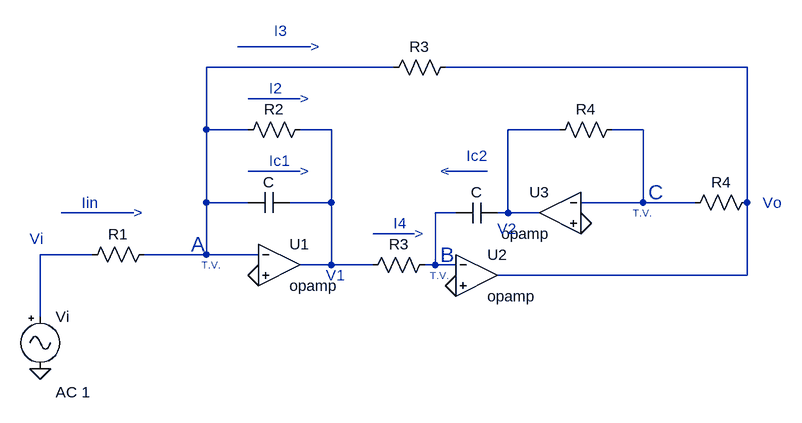
[diagram p0: schematic TS2_analisis.asc]
TS2_analisis.asc, the LTspice schematic file:
Version 4
SHEET 1 880 680
WIRE 96 -192 -16 -192
WIRE 224 -160 -64 -160
WIRE 768 -160 304 -160
WIRE 80 -112 0 -112
WIRE -64 -64 -64 -160
WIRE 0 -64 -64 -64
WIRE 128 -64 80 -64
WIRE 480 -64 400 -64
WIRE 608 -64 560 -64
WIRE 80 0 0 0
WIRE 368 0 304 0
WIRE -64 48 -64 -64
WIRE 0 48 -64 48
WIRE 128 48 128 -64
WIRE 128 48 64 48
WIRE 608 48 608 -64
WIRE 608 48 512 48
WIRE 688 48 608 48
WIRE 768 48 768 -160
WIRE -176 64 -288 64
WIRE 320 64 288 64
WIRE 400 64 400 -64
WIRE 400 64 384 64
WIRE 448 64 400 64
WIRE 256 96 192 96
WIRE -240 128 -320 128
WIRE -64 128 -64 48
WIRE -64 128 -160 128
WIRE 16 128 -64 128
WIRE 128 144 128 48
WIRE 128 144 80 144
WIRE 192 144 128 144
WIRE 288 144 288 64
WIRE 288 144 272 144
WIRE 320 144 288 144
WIRE 768 160 768 48
WIRE 768 160 384 160
WIRE -320 224 -320 128
FLAG 320 176 0
FLAG 16 160 0
FLAG 512 80 0
FLAG -320 304 0
SYMBOL OpAmps\\opamp 48 80 R0
SYMATTR InstName U1
SYMBOL OpAmps\\opamp 352 96 R0
SYMATTR InstName U2
SYMBOL OpAmps\\opamp 480 0 M0
SYMATTR InstName U3
SYMBOL res 576 -80 R90
WINDOW 0 0 56 VBottom 2
WINDOW 3 32 56 VTop 2
SYMATTR InstName R4
SYMATTR Value ""
SYMBOL res 784 32 R90
WINDOW 0 0 56 VBottom 2
WINDOW 3 32 56 VTop 2
SYMATTR InstName R4
SYMATTR Value ""
SYMBOL res 288 128 R90
WINDOW 0 0 56 VBottom 2
WINDOW 3 32 56 VTop 2
SYMATTR InstName R3
SYMATTR Value ""
SYMBOL cap 64 32 R90
WINDOW 0 0 32 VBottom 2
WINDOW 3 32 32 VTop 2
SYMATTR InstName C
SYMATTR Value ""
SYMBOL cap 384 48 R90
WINDOW 0 0 32 VBottom 2
WINDOW 3 32 32 VTop 2
SYMATTR InstName C
SYMATTR Value ""
SYMBOL res -144 112 R90
WINDOW 0 0 56 VBottom 2
WINDOW 3 32 56 VTop 2
SYMATTR InstName R1
SYMATTR Value ""
SYMBOL res 96 -80 R90
WINDOW 0 0 56 VBottom 2
WINDOW 3 32 56 VTop 2
SYMATTR InstName R2
SYMATTR Value ""
SYMBOL Misc\\signal -320 208 R0
WINDOW 123 24 132 Left 2
WINDOW 39 0 0 Left 0
SYMATTR Value2 AC 1
SYMATTR InstName Vi
SYMATTR Value ""
SYMBOL res 320 -176 R90
WINDOW 0 0 56 VBottom 2
WINDOW 3 32 56 VTop 2
SYMATTR InstName R3
SYMATTR Value ""
TEXT -176 64 Left 2 ;>
TEXT -256 48 Left 2 ;Iin
TEXT 96 -192 Left 2 ;>
TEXT 40 -216 Left 2 ;I3
TEXT 80 -112 Left 2 ;>
TEXT 32 -128 Left 2 ;I2
TEXT 80 0 Left 2 ;>
TEXT 32 -16 Left 2 ;Ic1
TEXT -72 144 Left 1 ;T.V.
TEXT 280 160 Left 1 ;T.V.
TEXT -88 112 Left 3 ;A
TEXT 296 128 Left 3 ;B
TEXT 120 160 Left 2 ;V1
TEXT 384 88 Left 2 ;V2
TEXT 616 32 Left 3 ;C
TEXT 792 48 Left 2 ;Vo
TEXT -336 104 Left 2 ;Vi
TEXT 296 0 Left 2 ;<
TEXT 336 -24 Left 2 ;Ic2
TEXT 224 80 Left 2 ;I4
TEXT 256 96 Left 2 ;>
TEXT 592 64 Left 1 ;T.V.

The netlist it stands for:
* TS2_analisis.asc
XU1 N002 0 N005 opamp Aol=100K GBW=10Meg  ; pins invin noninvin out
XU2 N011 0 N003 opamp Aol=100K GBW=10Meg  ; pins invin noninvin out
XU3 N007 0 N006 opamp Aol=100K GBW=10Meg  ; pins invin noninvin out
R4 N007 N006
R4 N003 N007
R3 N011 N005
C N005 N002
C N006 N011
R1 N002 N013
R2 N005 N002
Vi N013 0 AC 1
R3 N003 N002
* >
* Iin
* >
* I3
* >
* I2
* >
* Ic1
* T.V.
* T.V.
* A
* B
* V1
* V2
* C
* Vo
* Vi
* <
* Ic2
* I4
* >
* T.V.
.backanno
.end